# EAGLE design Switch Breakout - Schematic (EAGLE 6.5.0)
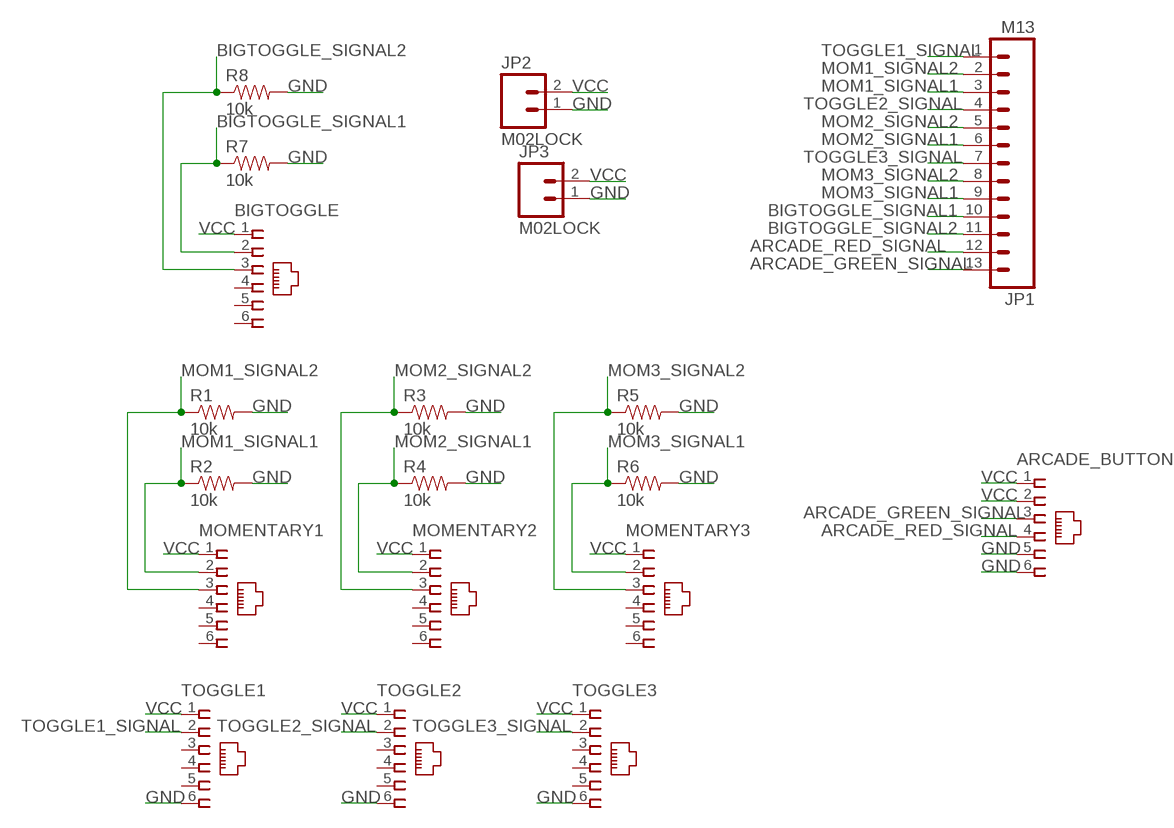
[diagram p0: schematic, sheet 1]

## Parts
ARCADE_BUTTONS  555165-1  [555165-1]
BIGTOGGLE  555165-1  [555165-1]
JP1  M13  [1X13]
JP2  M02LOCK  [1X02_LOCK]
JP3  M02LOCK  [1X02_LOCK]
MOMENTARY1  555165-1  [555165-1]
MOMENTARY2  555165-1  [555165-1]
MOMENTARY3  555165-1  [555165-1]
R1  10k  RESISTOR0603  [0603-RES]
R2  10k  RESISTOR0603  [0603-RES]
R3  10k  RESISTOR0603  [0603-RES]
R4  10k  RESISTOR0603  [0603-RES]
R5  10k  RESISTOR0603  [0603-RES]
R6  10k  RESISTOR0603  [0603-RES]
R7  10k  RESISTOR0603  [0603-RES]
R8  10k  RESISTOR0603  [0603-RES]
TOGGLE1  555165-1  [555165-1]
TOGGLE2  555165-1  [555165-1]
TOGGLE3  555165-1  [555165-1]

## Nets
ARCADE_GREEN_SIGNAL: ARCADE_BUTTONS.3 JP1.13
ARCADE_RED_SIGNAL: ARCADE_BUTTONS.4 JP1.12
BIGTOGGLE_SIGNAL1: BIGTOGGLE.2 JP1.10 R7.1
BIGTOGGLE_SIGNAL2: BIGTOGGLE.3 JP1.11 R8.1
GND: ARCADE_BUTTONS.5 ARCADE_BUTTONS.6 JP2.1 JP3.1 R1.2 R2.2 R3.2 R4.2 R5.2 R6.2 R7.2 R8.2 TOGGLE1.6 TOGGLE2.6 TOGGLE3.6
MOM1_SIGNAL1: JP1.3 MOMENTARY1.2 R2.1
MOM1_SIGNAL2: JP1.2 MOMENTARY1.3 R1.1
MOM2_SIGNAL1: JP1.6 MOMENTARY2.2 R4.1
MOM2_SIGNAL2: JP1.5 MOMENTARY2.3 R3.1
MOM3_SIGNAL1: JP1.9 MOMENTARY3.2 R6.1
MOM3_SIGNAL2: JP1.8 MOMENTARY3.3 R5.1
TOGGLE1_SIGNAL: JP1.1 TOGGLE1.2
TOGGLE2_SIGNAL: JP1.4 TOGGLE2.2
TOGGLE3_SIGNAL: JP1.7 TOGGLE3.2
VCC: ARCADE_BUTTONS.1 ARCADE_BUTTONS.2 BIGTOGGLE.1 JP2.2 JP3.2 MOMENTARY1.1 MOMENTARY2.1 MOMENTARY3.1 TOGGLE1.1 TOGGLE2.1 TOGGLE3.1
Unconnected: BIGTOGGLE.4 BIGTOGGLE.5 BIGTOGGLE.6 MOMENTARY1.4 MOMENTARY1.5 MOMENTARY1.6 MOMENTARY2.4 MOMENTARY2.5 MOMENTARY2.6 MOMENTARY3.4 MOMENTARY3.5 MOMENTARY3.6 TOGGLE1.3 TOGGLE1.4 TOGGLE1.5 TOGGLE2.3 TOGGLE2.4 TOGGLE2.5 TOGGLE3.3 TOGGLE3.4 TOGGLE3.5

## Library data of the parts
ARCADE_BUTTONS BIGTOGGLE MOMENTARY1-MOMENTARY3 TOGGLE1-TOGGLE3 = con-amp:555165-1: AMP connector
JP1 = SparkFun-Connectors:M13: 13-pin single row .1" header
JP2 JP3 = SparkFun-Connectors:M02: Standard 2-pin 0.1" header. Use with - straight break away headers ( PRT-00116) - right angle break away headers (PRT-00553) - swiss pins (PRT-00743) - machine pins (PRT-00117) - female headers (PRT-00115) Molex polarized connector foot print use with: PRT-08233 with associated crimp pins and housings. 2.54_SCREWTERM for use with PRT-10571. 3.5mm Screw Terminal footprints for PRT-08084 5mm Screw Terminal footprints for use with PRT-08433
R1-R8 = SparkFun-Resistors:RESISTOR: Resistor Basic schematic elements and footprints for 0603, 1206, and PTH resistors.

## Board
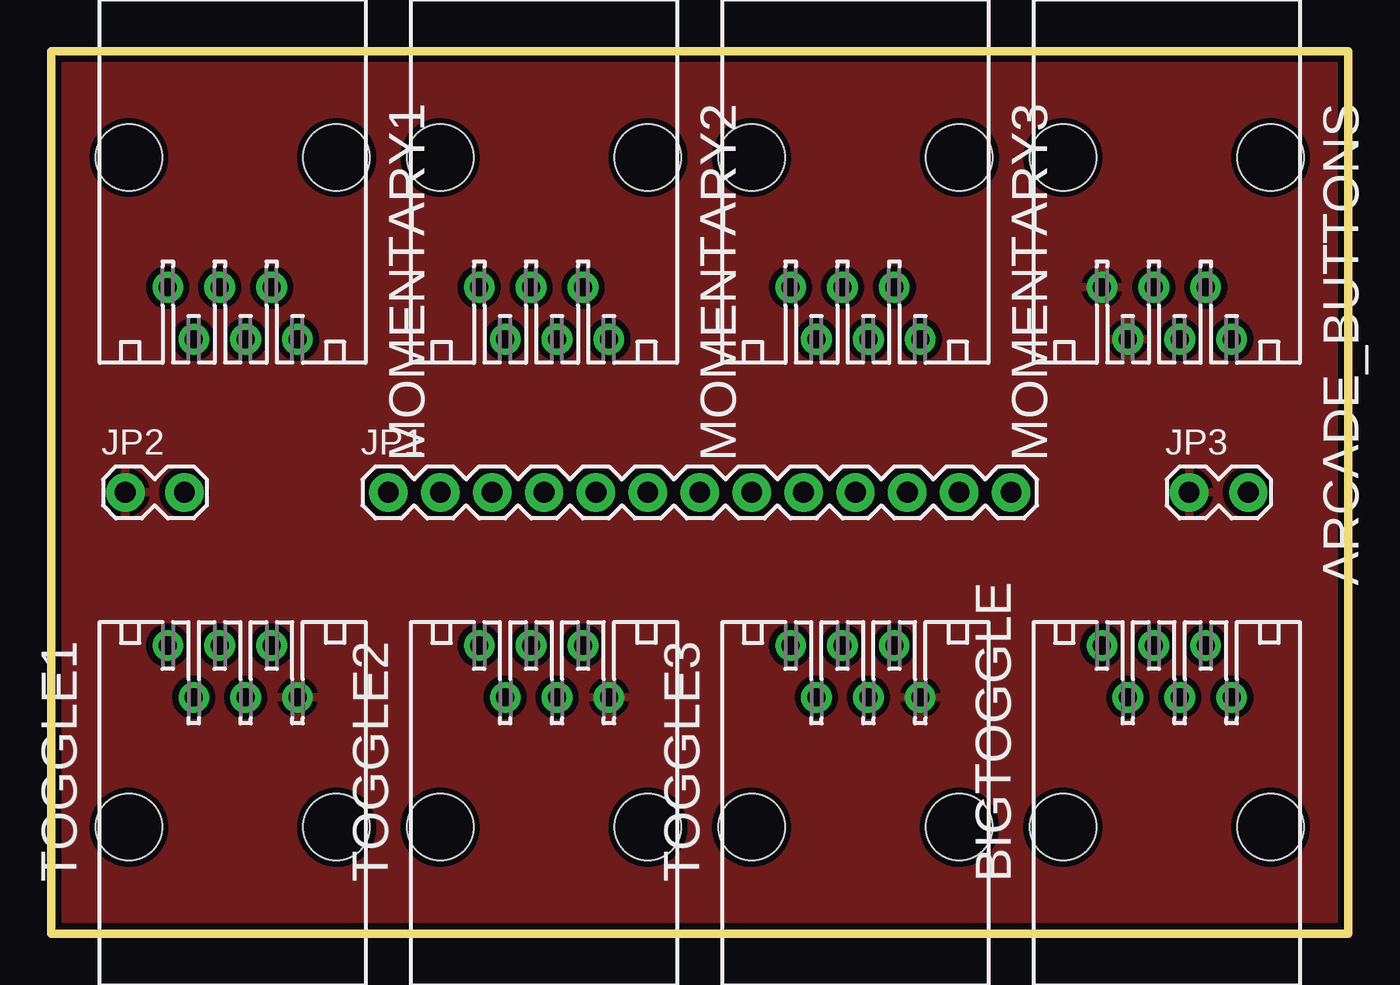
[diagram p1: board, top side]
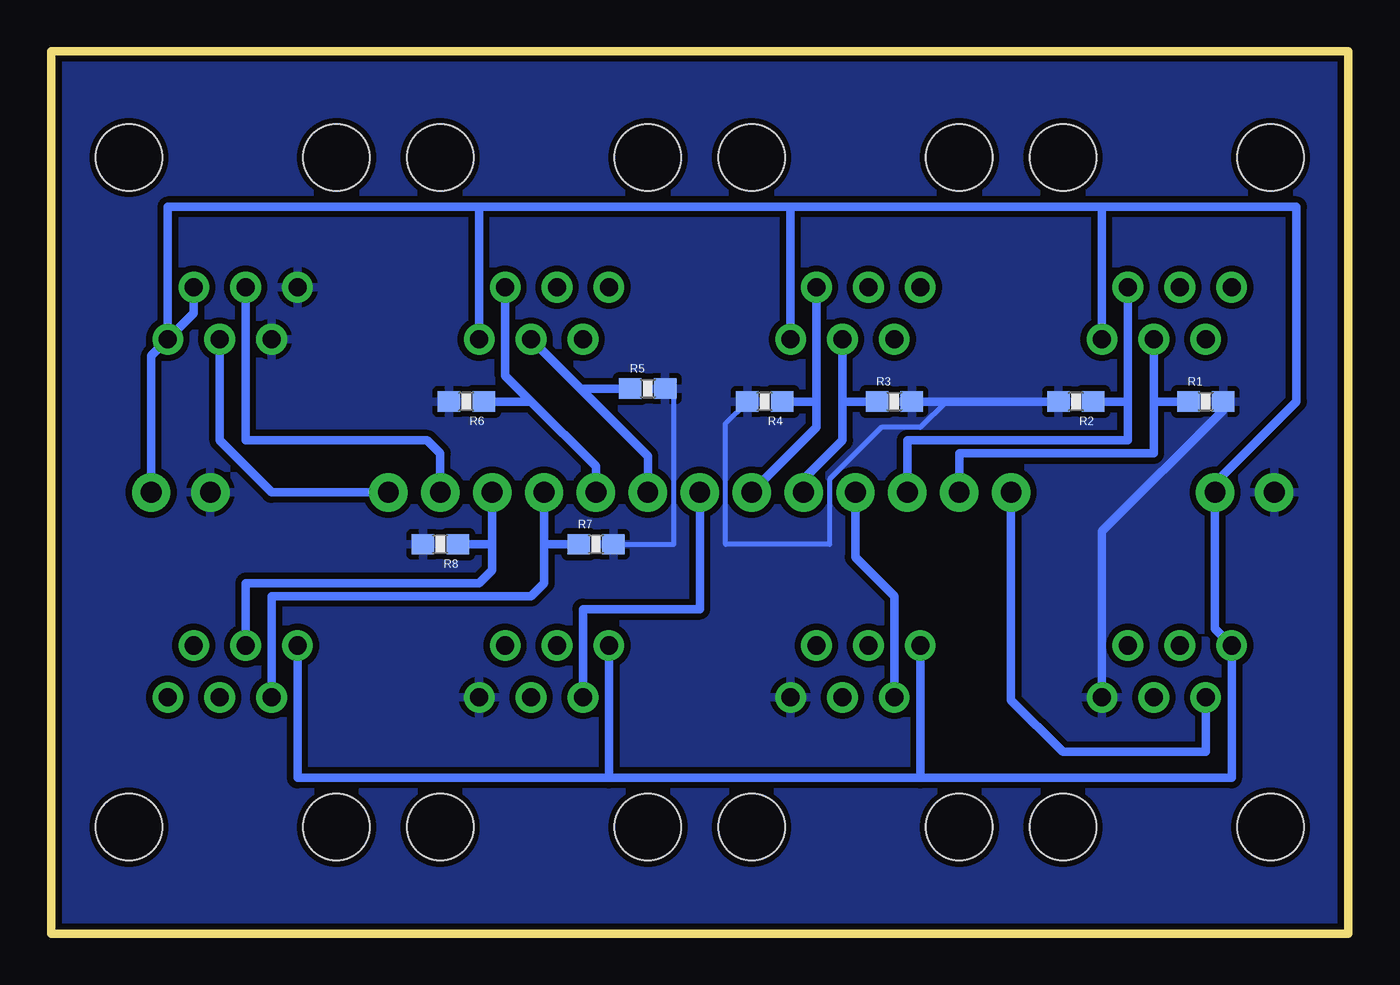
[diagram p2: board, bottom side, seen from below]

Size 63.5 x 43.18 mm. Coordinates in mm from the lower left corner, seen from the top.
Outline: 0,0 0,43.18 63.5,43.18 63.5,0 0,0
Copper layers (1*16): Top 0.035mm / dielectric 1.5mm / Bottom 0.035mm
Design rules "SparkFun": minimum track width 8mil, minimum drill 20mil, track to track 8mil, track to pad 8mil, pad to pad 8mil, via to via 8mil, smd to smd 8mil, copper to edge 8mil, drill to drill 8mil, minimum pad ring 12mil, minimum via ring 10mil, stop-mask expansion 4mil, vias tented up to drill 20mil, thermal gap 10mil

### Footprints (pad centres in the part's own frame; a part is rotated, then mirrored left to right if it is on the bottom)
555165-1 = drill 0.889: 1 -3.175,7.747; 2 -1.905,5.207; 3 -0.635,7.747; 4 0.635,5.207; 5 1.905,7.747; 6 3.175,5.207 | hole 3.251: -5.08,-1.143; 5.08,-1.143
1X13 = drill 1.016 pad 1.88: 1 0,0; 2 2.54,0; 3 5.08,0; 4 7.62,0; 5 10.16,0; 6 12.7,0; 7 15.24,0; 8 17.78,0; 9 20.32,0; 10 22.86,0; 11 25.4,0; 12 27.94,0; 13 30.48,0
1X02_LOCK = drill 1.016 pad 1.88: 1 -0.178,0; 2 2.718,0
0603-RES = smd 1.1 x 1: 1 -0.85,0; 2 0.85,0

### Placement (x,y rotation side)
ARCADE_BUTTONS  54.61,36.83 180 top
BIGTOGGLE  54.61,6.35 0 top
JP1  16.51,21.59 0 top
JP2  3.81,21.59 0 top
JP3  55.88,21.59 0 top
MOMENTARY1  8.89,36.83 180 top
MOMENTARY2  24.13,36.83 180 top
MOMENTARY3  39.37,36.83 180 top
R1  6.99,26.04 0 bottom
R2  13.34,26.04 180 bottom
R3  22.23,26.04 0 bottom
R4  28.57,26.04 180 bottom
R5  34.29,26.67 0 bottom
R6  43.18,26.04 180 bottom
R7  36.83,19.05 0 bottom
R8  44.45,19.05 180 bottom
TOGGLE1  8.89,6.35 0 top
TOGGLE2  24.13,6.35 0 top
TOGGLE3  39.37,6.35 0 top

### Tracks (layer width: path | path; a pad name or v marks a point on that pad's centre or on a via)
ARCADE_GREEN_SIGNAL
  Bottom 0.406: JP1.13 52.7,21.59 55.24,24.13 ARCADE_BUTTONS.3
ARCADE_RED_SIGNAL
  Bottom 0.406: JP1.12 44.45,23.5 45.09,24.13 53.98,24.13 ARCADE_BUTTONS.4
BIGTOGGLE_SIGNAL1
  Bottom 0.406: JP1.10 39.37,19.05 | 39.37,19.05 39.37,17.14 40.01,16.51 52.7,16.51 BIGTOGGLE.2 | R7.1 39.37,19.05
BIGTOGGLE_SIGNAL2
  Bottom 0.406: JP1.11 41.91,19.05 | 41.91,19.05 41.91,17.78 42.55,17.14 53.98,17.14 BIGTOGGLE.3 | R8.1 41.91,19.05
GND
  Bottom 0.254: R7.2 33.02,19.05 33.02,26.25 R5.2 | 19.68,26.04 20.95,24.77 22.86,24.77 25.4,22.23 25.4,19.05 30.48,19.05 30.48,24.98 R4.2
  Bottom 0.406: R1.2 6.13,25.61 12.06,19.68 TOGGLE1.6 | R3.2 R2.2 19.68,26.04
  pour Bottom (isolate 0.305): 0,0 0,43.18 63.5,43.18 63.5,0
  pour Top (isolate 0.305): 0,0 0,43.18 63.5,43.18 63.5,0
MOM1_SIGNAL1
  Bottom 0.406: JP1.3 21.59,24.13 10.79,24.13 10.79,26.04 | 10.79,26.04 MOMENTARY1.2 | R2.1 10.79,26.04
MOM1_SIGNAL2
  Bottom 0.406: JP1.2 19.05,23.5 9.53,23.5 9.53,26.04 | 9.53,26.04 MOMENTARY1.3 | R1.1 9.53,26.04
MOM2_SIGNAL1
  Bottom 0.406: JP1.6 26.04,24.77 26.04,26.04 | 26.04,26.04 MOMENTARY2.2 | R4.1 26.04,26.04
MOM2_SIGNAL2
  Bottom 0.406: JP1.5 26.67,22.23 24.77,24.13 24.77,26.04 | 24.77,26.04 MOMENTARY2.3 | R3.1 24.77,26.04
MOM3_SIGNAL1
  Bottom 0.406: JP1.9 36.83,22.86 40.01,26.04 | 40.01,26.04 41.27,27.3 MOMENTARY3.2 | R6.1 40.01,26.04
MOM3_SIGNAL2
  Bottom 0.406: JP1.8 34.29,23.37 37.53,26.61 | 37.53,26.61 MOMENTARY3.3 | R5.1 37.47,26.67 37.53,26.61
TOGGLE1_SIGNAL
  Bottom 0.406: JP1.1 16.51,11.43 13.97,8.89 6.99,8.89 TOGGLE1.2
TOGGLE2_SIGNAL
  Bottom 0.406: JP1.4 24.13,18.41 22.23,16.51 TOGGLE2.2
TOGGLE3_SIGNAL
  Bottom 0.406: TOGGLE3.2 37.47,15.88 31.75,15.88 JP1.7
VCC
  Bottom 0.406: 12.06,35.56 2.54,35.56 2.54,26.04 6.53,22.05 JP2.2 6.53,14.91 TOGGLE1.1 5.71,7.62 20.95,7.62 | 12.06,35.56 27.3,35.56 | 27.3,35.56 42.55,35.56 | 42.55,35.56 57.78,35.56 ARCADE_BUTTONS.1 | MOMENTARY3.1 42.55,35.56 | MOMENTARY2.1 27.3,35.56 | MOMENTARY1.1 12.06,35.56 | 20.95,7.62 36.2,7.62 | 36.2,7.62 51.44,7.62 BIGTOGGLE.1 | TOGGLE3.1 36.2,7.62 | TOGGLE2.1 20.95,7.62 | ARCADE_BUTTONS.2 56.52,30.35 ARCADE_BUTTONS.1 | JP3.2 58.6,28.27 ARCADE_BUTTONS.1